# EAGLE schematic Schematic (EAGLE 9.6.2)
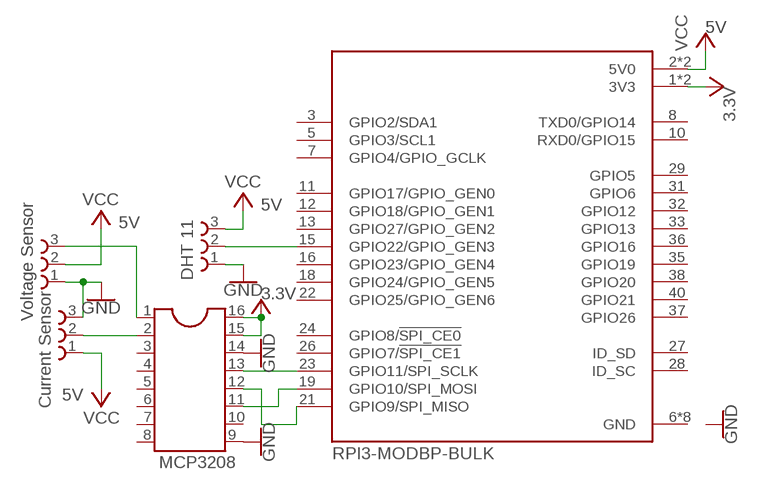
[diagram p0: schematic, sheet 1]

## Parts
IC1  MCP3208  DIL16S  [SOCKET-16]
J1  Current Sensor  61300311821  [61300311821]
J2  Voltage Sensor  61300311821  [61300311821]
J3  DHT 11  61300311821  [61300311821]
U1  RPI3-MODBP-BULK  [MODULE_RPI3-MODBP-BULK]

## Nets
GND: IC1.9 IC1.14 J1.3 J2.1 J3.1
N$1: IC1.13 U1.23(GPIO11/SPI_SCLK)
N$2: IC1.11 U1.19(GPIO10/SPI_MOSI)
N$3: IC1.12 U1.21(GPIO9/SPI_MISO)
N$4: IC1.1 J2.3
N$5: IC1.2 J1.2
N$6: J3.2 U1.15(GPIO22/GPIO_GEN3)
VCC: IC1.15 IC1.16 J1.1 J2.2 J3.3 U1.1(3V3) U1.2(5V0) U1.4(5V0) U1.17(3V3)
Unconnected: IC1.3 IC1.4 IC1.5 IC1.6 IC1.7 IC1.8 IC1.10 U1.3(GPIO2/SDA1) U1.5(GPIO3/SCL1) U1.7(GPIO4/GPIO_GCLK) U1.8(TXD0/GPIO14) U1.10(RXD0/GPIO15) U1.11(GPIO17/GPIO_GEN0) U1.12(GPIO18/GPIO_GEN1) U1.13(GPIO27/GPIO_GEN2) U1.16(GPIO23/GPIO_GEN4) U1.18(GPIO24/GPIO_GEN5) U1.22(GPIO25/GPIO_GEN6) U1.24(GPIO8/!SPI_CE0) U1.26(GPIO7/!SPI_CE1) U1.27(ID_SD) U1.28(ID_SC) U1.29(GPIO5) U1.31(GPIO6) U1.32(GPIO12) U1.33(GPIO13) U1.35(GPIO19) U1.36(GPIO16) U1.37(GPIO26) U1.38(GPIO20) U1.40(GPIO21)

## Power pins joined to a net without a drawn wire
GND: U1.6(GND) U1.9(GND) U1.14(GND) U1.20(GND) U1.25(GND) U1.30(GND) U1.34(GND) U1.39(GND)

## Library data of the parts
IC1 = ic-package:DIL16: Dual In Line / Socket
J1-J3 = Female Header 3 socket:61300311821: WR-PHD 2.54mm Socket Header, 3 Pins =>Code : Con_BTB_SHD_2.54_1_THT_61300311821 <http://katalog.we-online.de/media/images/eican/Con_BTB_SHD_2.54_1_THT_6130xx11821_pf2.jpg> Details see: http://katalog.we-online.de/en/em/613_0xx_118_21 Created 2014-05-29, Karrer Zheng 2014 (C) Würth Elektronik Check availability <https://pricing.snapeda.com/parts/61300311821/W%C3%BCrth%20Elektronik/view-part?ref=eda>; AVAILABILITY: In Stock; DESCRIPTION: Female header Temperature range: -40 ... +125 °C Colour: Black Connector Design: Single Row / Straight / Without Shroud Connector Termination: THT Contact material: Gold-Plated Copper Gender of contacts: Female Housing Material: Polybutylene Terephthalate (PBT) Pitch: 2.54 mm Series: WR-PHD Poles: 3 Rated current: 3 A Rated voltage: 250 VAC; MF: Würth Elektronik; MP: 61300311821; PACKAGE: None; PRICE: None; PURCHASE-URL: https://pricing.snapeda.com/search/part/61300311821/?ref=eda
U1 = RPI3-MODBP-BULK:RPI3-MODBP-BULK: Check availability <https://pricing.snapeda.com/parts/RPI3-MODBP-BULK/Raspberry%20Pi/view-part?ref=eda>; AVAILABILITY: Not in stock; DESCRIPTION: BCM2837B0 Raspberry Pi 3 Model B+ - ARM® Cortex®-A53, VideoCore MPU Embedded Evaluation Board; MF: Raspberry Pi; MP: RPI3-MODBP-BULK; PACKAGE: None; PRICE: None